# Altium project XL4015 Buck Converter.PrjPcb
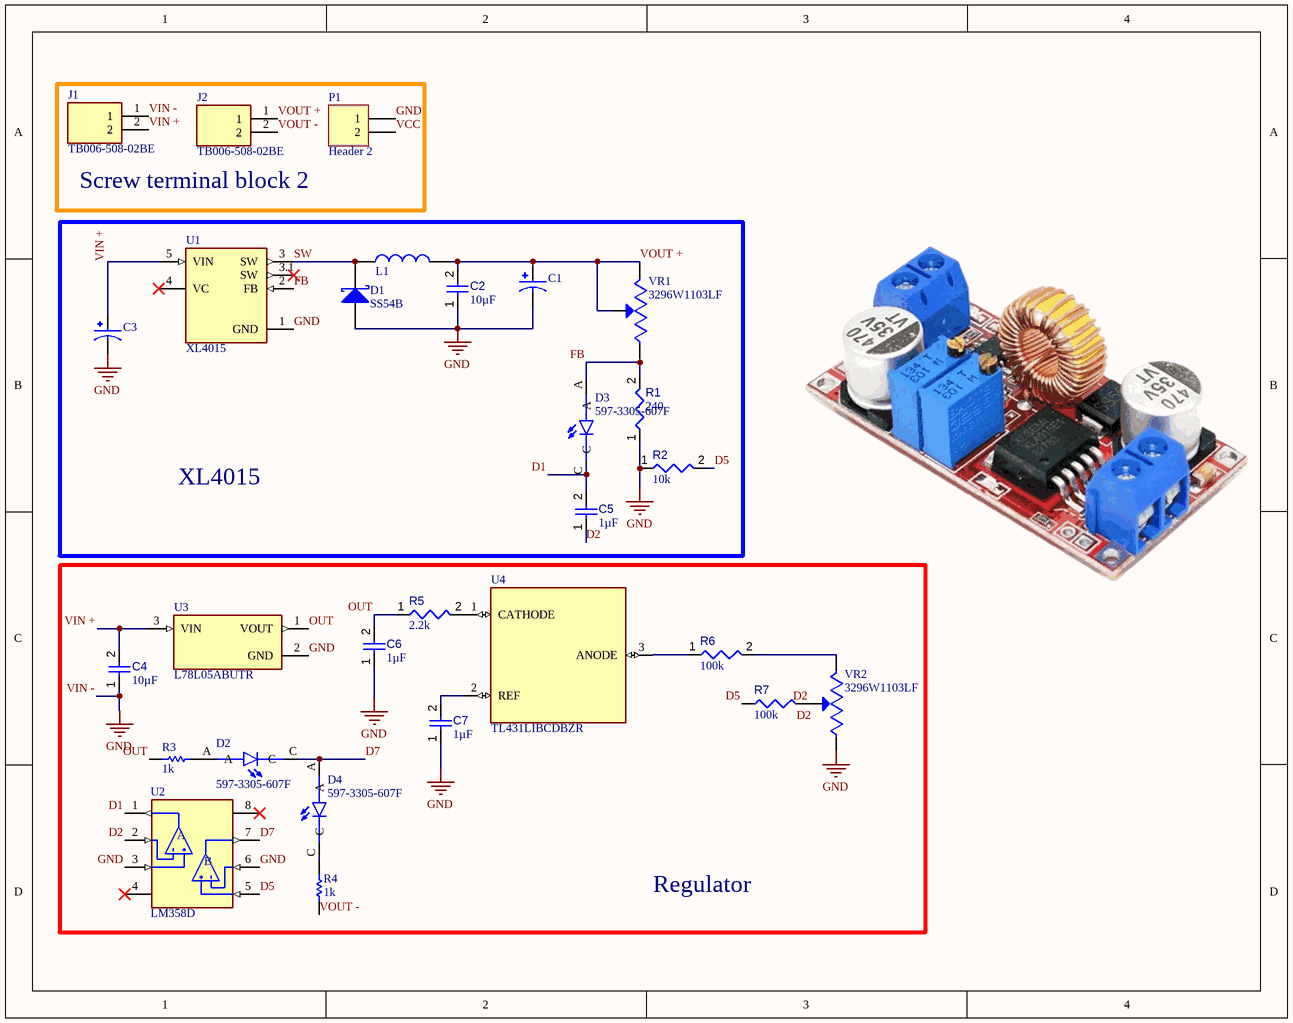
[diagram p0: Sheet1.SchDoc]
1 sheet, 28 parts. Net scope: global (net labels, ports and power ports of the same name join across sheets).
Board file: PCB1.PcbDoc

## Sheet Sheet1.SchDoc
size A; SheetNumber: 1; SheetTotal: 1; SPICEModelCacheXHJZIRBU: <root> / <DocumentId>XHJZIRBU</DocumentId> / <CacheFrame Number="0"> / <Model Name="7447035_15u" Kind="CKT"> / <Text>******* / .subckt 7447035_15u 1 2 / Rp 1 2 1344 / Cp 1 2 1.749p / Rs 1 N3 0.025 / L1 N3 2 15u / .ends 7447035_15u</Text> / </Model> / </CacheFrame> / </root>

### Parts
C1  EEEFN1V471UP  [CAP_EEEFN1V471UP]  (value not drawn)
C2  value 10µF  [CAPC0603(1608)100_L]  (hidden comment: Capacitor 10µF +/-20% 10V 0603)
C3  EEEFN1V471UP  [CAP_EEEFN1V471UP]  (value not drawn)
C4  value 10µF  [CAPC0603(1608)100_L]  (hidden comment: Capacitor 10µF +/-20% 10V 0603)
C5  value 1µF  [CAPC2013X145X50ML20T25]  (hidden comment: Capacitor 1 uF +/- 10% 25 V 0805)
C6  value 1µF  [CAPC2013X145X50ML20T25]  (hidden comment: Capacitor 1 uF +/- 10% 25 V 0805)
C7  value 1µF  [CAPC2013X145X50ML20T25]  (hidden comment: Capacitor 1 uF +/- 10% 25 V 0805)
D1  SS54B  [JCET-SMB-2_M]
D2  597-3305-607F  [LEDC2012X70N]
D3  597-3305-607F  [LEDC2012X70N]
D4  597-3305-607F  [LEDC2012X70N]
J1  TB006-508-02BE  [CUI_TB006-508-02BE]
J2  TB006-508-02BE  [CUI_TB006-508-02BE]
L1  15µH  [7447035]  (value not drawn)
P1  Header 2  [HDR1X2]
R1  value 240  [RESC0402(1005)_L]  (hidden comment: Resistor 240R +/-5 % 0402 63 mW)
R2  value 10k  [RESC0402(1005)_L]  (hidden comment: Resistor 10K  +/-1 % 0402 63 mW)
R3  value 1k  [RESC1005X40X25ML05T05]  (hidden comment: Resistor 1k +/-1% 0402 100 mW)
R4  value 1k  [RESC1005X40X25ML05T05]  (hidden comment: Resistor 1k +/-1% 0402 100 mW)
R5  value 2.2k  [RESC0402(1005)_L]  (hidden comment: Resistor 2K2  +/-5 % 0402 63 mW)
R6  value 100k  [RESC1005X40X25ML05T05]  (hidden comment: Resistor 100k +/-1% 0402 63 mW)
R7  value 100k  [RESC1005X40X25ML05T05]  (hidden comment: Resistor 100k +/-1% 0402 63 mW)
U1  XL4015  [CONV_XL4015]
U2  LM358D  [SOIC127P599X175-8N]
U3  L78L05ABUTR  [VREG_L78L05ABUTR]
U4  TL431LIBCDBZR  [SOT23]
VR1  3296W1103LF  [TRIM_3296W1103LF]
VR2  3296W1103LF  [TRIM_3296W1103LF]

### Blocks framed on the sheet
Screw terminal block 2: J1 J2 P1
XL4015: C1-C3 C5 D1 D3 L1 R1 R2 U1 VR1
Regulator: C4 C6 C7 D2 D4 R3-R7 U2-U4 VR2

### Nets
GND: C1.2 C2.1 C3.2 C4.1 C6.1 C7.1 D1.1(A) J1.1 P1.1 R1.1 R2.1 U1.1(GND) U2.3(IN1+) U2.6(IN2-) U3.2(GND) VR2.1(CCW)  [also labelled VIN -]
D1: C5.2 D3.C U2.1(OUT1)
D2: C5.1 R7.2 U2.2(IN1-) VR2.2(WIPER)
D5: R2.2 R7.1 U2.5(IN2+)
D7: D2.C D4.A U2.7(OUT2)
FB: D3.A R1.2 U1.2(FB) VR1.1(CCW)
OUT: C6.2 R3.1 R5.1 U3.1(VOUT)
SW: D1.2(K) L1.1 U1.3(SW)
VCC: P1.2
VIN +: C3.1 C4.2 J1.2 U1.5(VIN) U3.3(VIN)
VOUT +: C1.1 C2.2 J2.1 L1.2 VR1.2(WIPER) VR1.3(CW)
VOUT -: J2.2 R4.1
NetC7_2: C7.2 U4.2(REF)
NetD2_A: D2.A R3.2
NetD4_C: D4.C R4.2
NetR5_2: R5.2 U4.1(CATHODE)
NetR6_1: R6.1 U4.3(ANODE)
NetR6_2: R6.2 VR2.3(CW)

Not connected (* = marked no-connect by the designer): U1 3.1(SW)* 4(VC)*; U2 4(V-)* 8(V+)*

### Notes on the sheet
- Labels drawn without touching a wire or pin: D2
- (in symbol LM358D) A; B

### Library data of the parts
C1 C3 = EEEFN1V471UP: CAP ALUM 470UF 20% 35V SMD; MF: Panasonic Electronic Components; MP: EEE-FN1V471UP; Check_prices: https://www.snapeda.com/parts/EEE-FN1V471UP/Panasonic/view-part/6178317/?ref=eda; SnapEDA_Link: https://www.snapeda.com/parts/EEE-FN1V471UP/Panasonic/view-part/6178317/?ref=snap; Availability: In Stock; Package: RADIAL-2 Panasonic; Price: None; Value: *
C2 C4 = CMP-001-00075-4: Chip Capacitor, 10µF +/-20%, 10V, 0603, Thickness 1 mm; Tolerance: 10%; Voltage Rating: 10V; Max Operating Temperature: 85°C; Pins: 2; Case/Package: 0603; Mounting Technology: SMT; Min Operating Temperature: -55°C
C5-C7 = CMP-001-00010-6: Chip Capacitor, 1 uF, +/-10%, 25 V, 0805 (2012 Metric); Capacitor Type: Ceramic; Voltage Rating: 25V; RoHS Compliant: True; Pins: 2; Mounting Technology: SM; Max Operating Temperature: 125°C; Min Operating Temperature: -55°C; Tolerance: 10%; Case/Package: 0805
D1 = CMP-004-00006-2: Schottky Barrier Rectifier, 40 V, 5 A, -55 to 150 degC, 2-Pin SMD; Manufacturer: JCET; Datasheet URL: http://wiki.seeedstudio.com/images/3/3f/0310130P1.pdf; Datasheet Version: May-13; Package Reference: SMB-2; RoHS Compliant: Unknown; Manufacturer URL: http://www.cj-elec.com/; Mounting Technology: SM; Package Description: 2-Pin Surface Mount Device, Body 4.315 x 3.62 mm; Case/Package: SMB-2
D2-D4 = 597-3305-607F: LED Uni-Color Green 4-Pin Chip 0805 T/R; Availability: Unavailable; Value: *; Price: None; MP: 597-3305-607F; Package: None
J1 J2 = TB006-508-02BE: 2~24 Poles, Screw Type, Horizontal, 5.08 Pitch, 26~14 (AWG), Terminal Block Connector; MF: Same Sky; SnapEDA_Link: https://www.snapeda.com/parts/TB006-508-02BE/Same+Sky/view-part/?ref=snap; Package: None; Value: *; MP: TB006-508-02BE; Check_prices: https://www.snapeda.com/parts/TB006-508-02BE/Same+Sky/view-part/?ref=eda
L1 = 7447035: WE-FI THT Leaded Toroidal Line Choke, 15µH, 4.5A, 0.025Ω; Manufacturer: Wurth Elektronik; Manufacturer Part Number: 7447035; Category: Filter Chokes; Match Code: WE-FI; ComponentLink1Description: Website Link; ComponentLink1URL: https://www.we-online.com/redexpert/article/7447035?ad; ComponentLink2Description: Datasheet Link; ComponentLink2URL: https://www.we-online.com/redexpert/spec/7447035?ad; Mount: Through Hole; Operating Temperature Max: 105°C; Operating Temperature Min: -40°C; Packaging: Tray; Length: 13.5mm; Width: 6.7mm; Height: 13.5mm; DC Resistance Max: 0.025Ω; Inductance: 15µH; Rated Current: 4.5A
P1 = CMP-002-00141-1: Header, 2-Pin; Signal Integrity: Connector; LatestRevisionDate: 17-Jul-2002; Pins: 2; Design Item ID: Header 2; Component Type: Standard; Source: Miscellaneous Connectors.SchLib; LatestRevisionNote: Re-released for DXP Platform.; Publisher: Altium Limited
R1 = CMP-009-00155-3: Chip Resistor, 240 Ohms, +/-5 %, 63 mW, -55 to 155 degC, 0402; Power: 63mW; Tolerance: 5%; Case/Package: 0402; Pins: 2; Max Operating Temperature: 155°C; Min Operating Temperature: -55°C
R2 = CMP-009-00149-3: Chip Resistor, 10 kOhms, +/-1 %, 63 mW, -55 to 125 degC, 0402; Power: 63mW; Tolerance: 1%; Min Operating Temperature: -55°C; Case/Package: 0402; Max Operating Temperature: 155°C; Pins: 2
R3 R4 = CMP-009-00009-5: Chip Resistor, 1 KOhm, +/- 1%, 0.1 W, -55 to 155 degC, 0402 (1005 Metric); Power: 100mW; Voltage Rating: 50V; Min Operating Temperature: -55°C; Max Operating Temperature: 155°C; RoHS Compliant: True; Mounting Technology: SM; Pins: 2; Tolerance: 1%; Case/Package: 0402
R5 = CMP-009-00166-3: Chip Resistor, 2,2 kOhms, +/-5 %, 63 mW, -55 to 155 degC, 0402; Power: 63mW; Tolerance: 5%; Pins: 2; Min Operating Temperature: -55°C; Max Operating Temperature: 155°C; Case/Package: 0402
R6 R7 = CMP-009-00021-5: Chip Resistor, 100 KOhm, +/- 1%, 0.063 W, -55 to 155 degC, 0402 (1005 Metric); Voltage Rating: 50V; Power: 63mW; Pins: 2; Tolerance: 1%; Max Operating Temperature: 155°C; Case/Package: 0402; Min Operating Temperature: -55°C; Mounting Technology: SM; RoHS Compliant: True
U1 = XL4015: 5A 180KHz 36V Buck DC to DC Converter; MF: XLSEMI; SnapEDA_Link: https://www.snapeda.com/parts/XL4015/XLSEMI/view-part/?ref=snap; Package: None; Value: *; MP: XL4015; Check_prices: https://www.snapeda.com/parts/XL4015/XLSEMI/view-part/?ref=eda
U2 = LM358D: Op Amp Dual Low Power Amplifier Â±15V/30V 8-Pin SO N Tube; MF: STMicroelectronics; SnapEDA_Link: https://www.snapeda.com/parts/LM358D/STMicroelectronics/view-part/?ref=snap; Package: None; Value: *; MP: LM358D; Check_prices: https://www.snapeda.com/parts/LM358D/STMicroelectronics/view-part/?ref=eda
U3 = L78L05ABUTR: Linear Voltage Regulator IC Positive Fixed 1 Output 100mA SOT-89-3; MF: STMicroelectronics; SnapEDA_Link: https://www.snapeda.com/parts/L78L05ABUTR/STMicroelectronics/view-part/?ref=snap; Package: SOT-89-3 STMicroelectronics; Value: *; MP: L78L05ABUTR; Check_prices: https://www.snapeda.com/parts/L78L05ABUTR/STMicroelectronics/view-part/?ref=eda
U4 = TL431LIBCDBZR: Adjustable precision shunt regulator with optimized reference current (pin layout: KRA); MF: Texas Instruments; SnapEDA_Link: https://www.snapeda.com/parts/TL431LIBCDBZR/Texas+Instruments/view-part/?ref=snap; Package: SOT-23-3 Texas Instruments; Value: *; MP: TL431LIBCDBZR; Check_prices: https://www.snapeda.com/parts/TL431LIBCDBZR/Texas+Instruments/view-part/?ref=eda
VR1 VR2 = 3296W1103LF: Trimmer, Potentiometer 10kohm 25turn Thd; MF: Bourns; Package: None; MP: 3296W1103LF; Check_prices: https://www.snapeda.com/parts/3296W1103LF/Bourns/view-part/2487625/?ref=eda; Availability: Unavailable; Price: None; Value: *; SnapEDA_Link: https://www.snapeda.com/parts/3296W1103LF/Bourns/view-part/2487625/?ref=snap